# EAGLE design TowerLight (EAGLE 6.6.0)
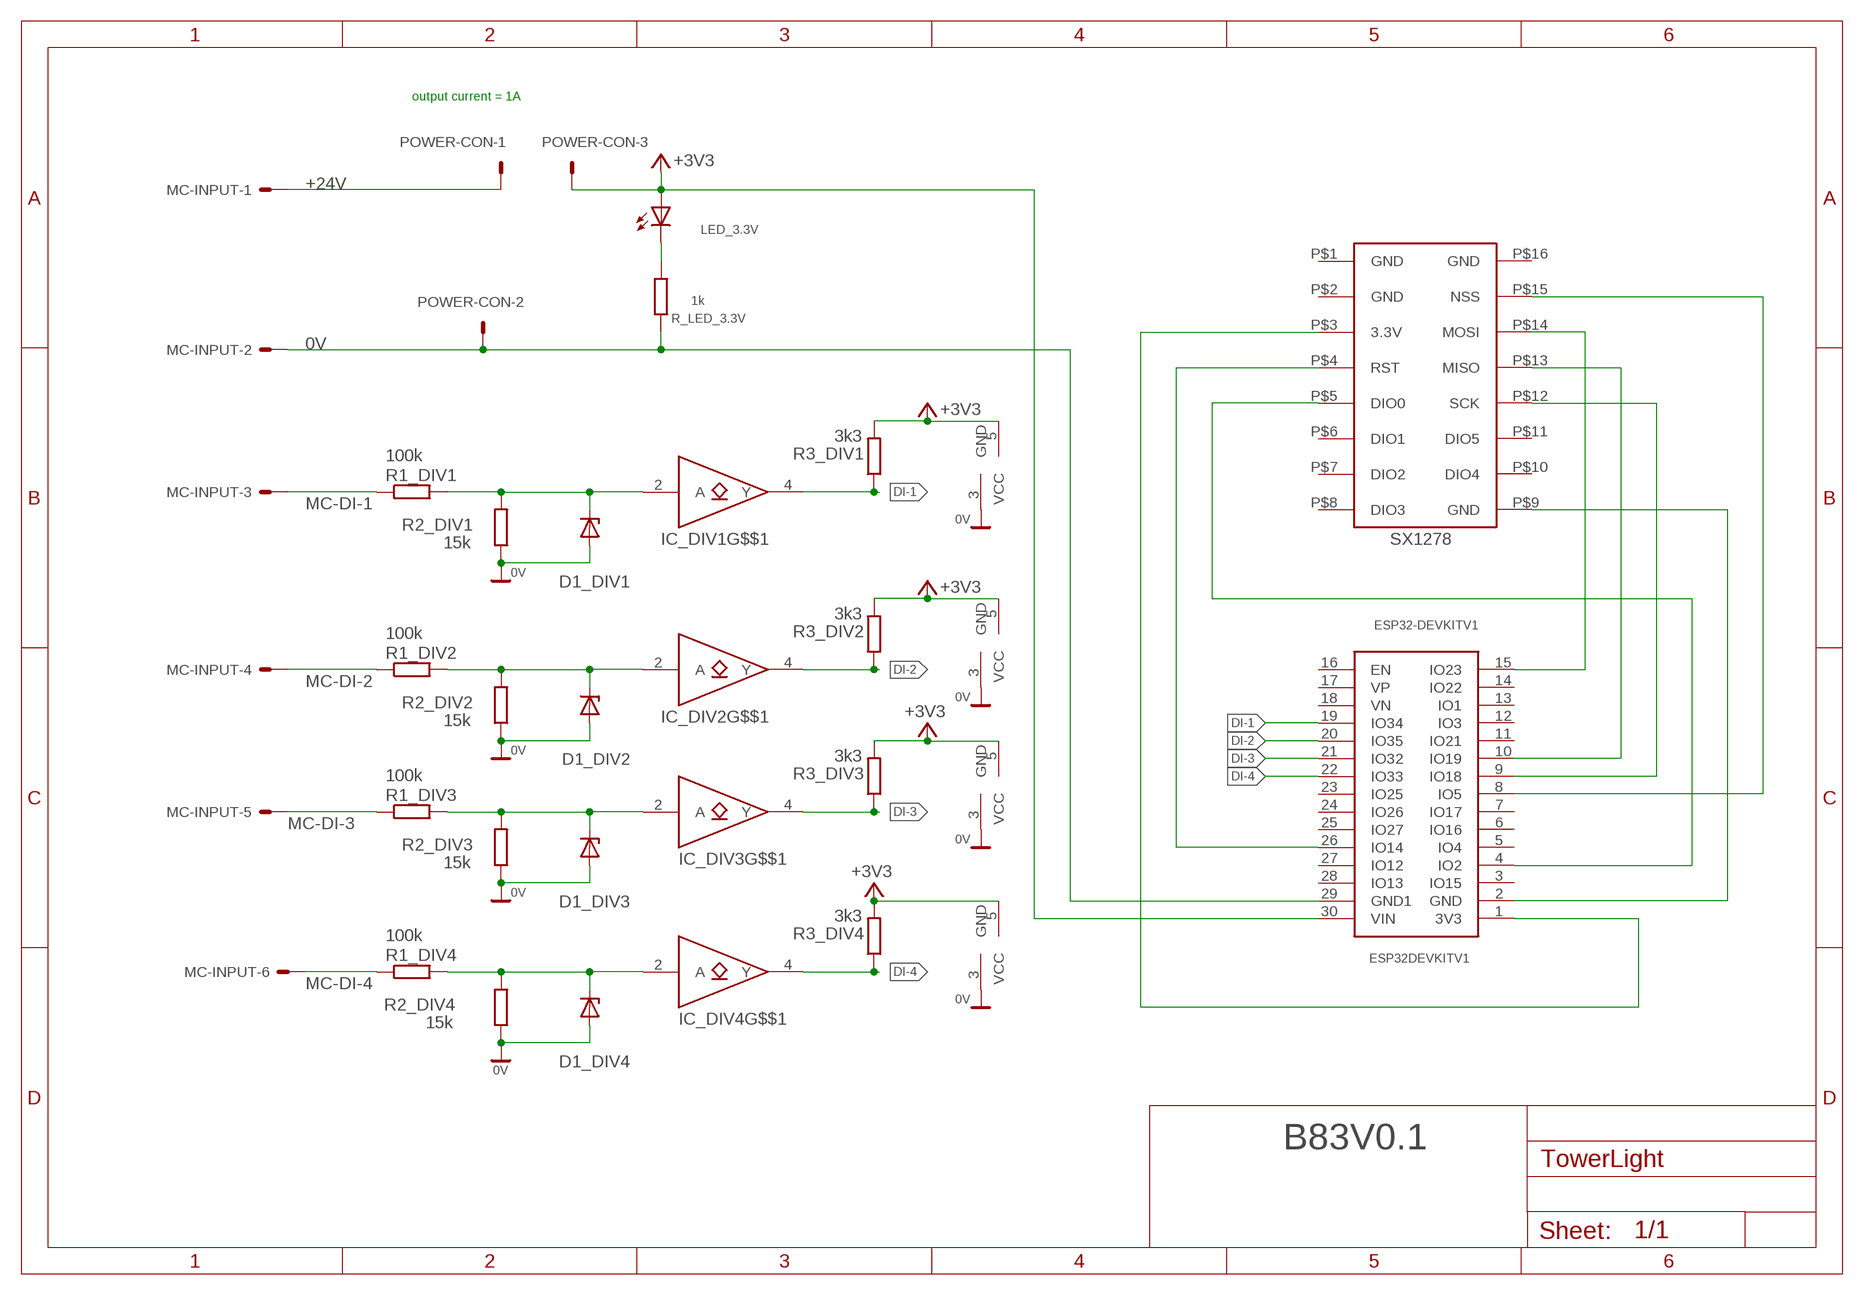
[diagram p0: schematic, sheet 1]

## Parts
D1_DIV1  ZENER-DIODEDO34-7  [DO34Z7]
D1_DIV2  ZENER-DIODEDO34-7  [DO34Z7]
D1_DIV3  ZENER-DIODEDO34-7  [DO34Z7]
D1_DIV4  ZENER-DIODEDO34-7  [DO34Z7]
ESP32DEVKITV1  ESP32DEVKITV1  [ESP32-DEVKITV1]
IC_DIV1  SN74LVC1G07DBVR  [SOT23-5L]
IC_DIV2  SN74LVC1G07DBVR  [SOT23-5L]
IC_DIV3  SN74LVC1G07DBVR  [SOT23-5L]
IC_DIV4  SN74LVC1G07DBVR  [SOT23-5L]
LED_3.3V  LED_SUB  [LED_SUBMINI]
MC-INPUT  22-05-7068-06  [7395-06]
POWER-CON  22-05-7038-03  [7395-03]
R1_DIV1  100k  R-EU_R1206  [R1206]
R1_DIV2  100k  R-EU_R1206  [R1206]
R1_DIV3  100k  R-EU_R1206  [R1206]
R1_DIV4  100k  R-EU_R1206  [R1206]
R2_DIV1  15k  R-EU_R1206  [R1206]
R2_DIV2  15k  R-EU_R1206  [R1206]
R2_DIV3  15k  R-EU_R1206  [R1206]
R2_DIV4  15k  R-EU_R1206  [R1206]
R3_DIV1  3k3  R-EU_R1206  [R1206]
R3_DIV2  3k3  R-EU_R1206  [R1206]
R3_DIV3  3k3  R-EU_R1206  [R1206]
R3_DIV4  3k3  R-EU_R1206  [R1206]
R_LED_3.3V  1k  R-EU_R1206  [R1206]
U$2  SX1278_MODULE  [SX1278_MODULE]

## Nets
0V: D1_DIV1.A D1_DIV2.A D1_DIV3.A D1_DIV4.A ESP32DEVKITV1.29(GND1) IC_DIV1.3(@:GND) IC_DIV2.3(@:GND) IC_DIV3.3(@:GND) IC_DIV4.3(@:GND) MC-INPUT.2 POWER-CON.2 R2_DIV1.1 R2_DIV2.1 R2_DIV3.1 R2_DIV4.1 R_LED_3.3V.2
+3V3: ESP32DEVKITV1.30(VIN) IC_DIV1.5(@:VCC) IC_DIV2.5(@:VCC) IC_DIV3.5(@:VCC) IC_DIV4.5(@:VCC) LED_3.3V.P$1(A) POWER-CON.3 R3_DIV1.2 R3_DIV2.2 R3_DIV3.2 R3_DIV4.2
+24V: MC-INPUT.1 POWER-CON.1
DI-1: ESP32DEVKITV1.19(IO34) IC_DIV1.4(G$$1:Y) R3_DIV1.1
DI-2: ESP32DEVKITV1.20(IO35) IC_DIV2.4(G$$1:Y) R3_DIV2.1
DI-3: ESP32DEVKITV1.21(IO32) IC_DIV3.4(G$$1:Y) R3_DIV3.1
DI-4: ESP32DEVKITV1.22(IO33) IC_DIV4.4(G$$1:Y) R3_DIV4.1
IN_IC_DR0: D1_DIV1.C IC_DIV1.2(G$$1:A) R1_DIV1.2 R2_DIV1.2
IN_IC_DR1: D1_DIV2.C IC_DIV2.2(G$$1:A) R1_DIV2.2 R2_DIV2.2
IN_IC_DR2: D1_DIV3.C IC_DIV3.2(G$$1:A) R1_DIV3.2 R2_DIV3.2
IN_IC_DR3: D1_DIV4.C IC_DIV4.2(G$$1:A) R1_DIV4.2 R2_DIV4.2
MC-DI-1: MC-INPUT.3 R1_DIV1.1
MC-DI-2: MC-INPUT.4 R1_DIV2.1
MC-DI-3: MC-INPUT.5 R1_DIV3.1
MC-DI-4: MC-INPUT.6 R1_DIV4.1
N$1: ESP32DEVKITV1.2(GND) U$2.P$9(GND)
N$2: ESP32DEVKITV1.9(IO18) U$2.P$12(SCK)
N$3: LED_3.3V.P$2(C) R_LED_3.3V.1
N$4: ESP32DEVKITV1.10(IO19) U$2.P$13(MISO)
N$5: ESP32DEVKITV1.15(IO23) U$2.P$14(MOSI)
N$6: ESP32DEVKITV1.8(IO5) U$2.P$15(NSS)
N$7: ESP32DEVKITV1.4(IO2) U$2.P$5(DIO0)
N$8: ESP32DEVKITV1.1(3V3) U$2.P$3(3.3V)
N$9: ESP32DEVKITV1.26(IO14) U$2.P$4(RST)
Unconnected: ESP32DEVKITV1.3(IO15) ESP32DEVKITV1.5(IO4) ESP32DEVKITV1.6(IO16) ESP32DEVKITV1.7(IO17) ESP32DEVKITV1.11(IO21) ESP32DEVKITV1.12(IO3) ESP32DEVKITV1.13(IO1) ESP32DEVKITV1.14(IO22) ESP32DEVKITV1.16(EN) ESP32DEVKITV1.17(VP) ESP32DEVKITV1.18(VN) ESP32DEVKITV1.23(IO25) ESP32DEVKITV1.24(IO26) ESP32DEVKITV1.25(IO27) ESP32DEVKITV1.27(IO12) ESP32DEVKITV1.28(IO13) U$2.P$1(GND) U$2.P$2(GND) U$2.P$6(DIO1) U$2.P$7(DIO2) U$2.P$8(DIO3) U$2.P$10(DIO4) U$2.P$11(DIO5) U$2.P$16(GND)

## Notes on the sheet
- output current = 1A
- B83V0.1

## Library data of the parts
D1_DIV1-D1_DIV4 = diode:ZENER-DIODE: Z-Diode
ESP32DEVKITV1 = ESP32-DEVKITV1:ESP32DEVKITV1
IC_DIV1-IC_DIV4 = TI SN74LVC1G07:SN74LVC1G07*: Single buffer/driver with Open-drain output Texas Instruments created by Simon Wong Peng Soon 30th November 2010 Rev:1.00
LED_3.3V = ZH:LED_SUB
MC-INPUT = con-molex:22-?-06: CONNECTOR wire to board 2.54 mm (.1 inch) pitch header; OC_FARNELL: unknown; OC_NEWARK: unknown
POWER-CON = con-molex:22-?-03: CONNECTOR wire to board 2.54 mm (.1 inch) pitch header; OC_FARNELL: unknown; OC_NEWARK: unknown
R1_DIV1-R1_DIV4 R2_DIV1-R2_DIV4 R3_DIV1-R3_DIV4 R_LED_3.3V = rcl:R-EU_: RESISTOR, European symbol
U$2 = simon:SX1278_MODULE: LoRa Module

## Board
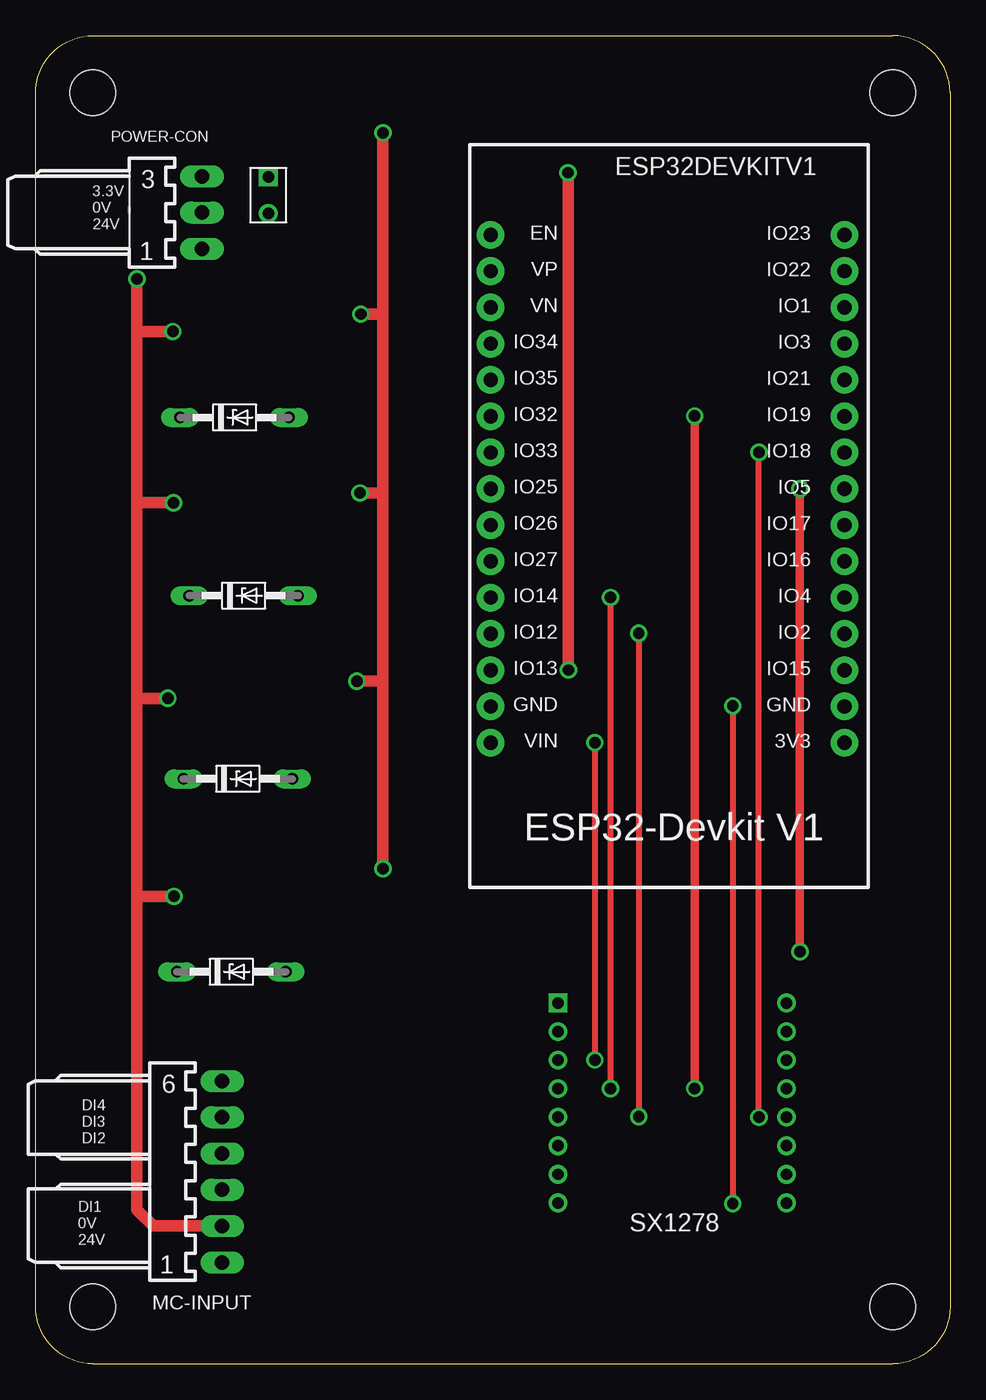
[diagram p1: board, top side]
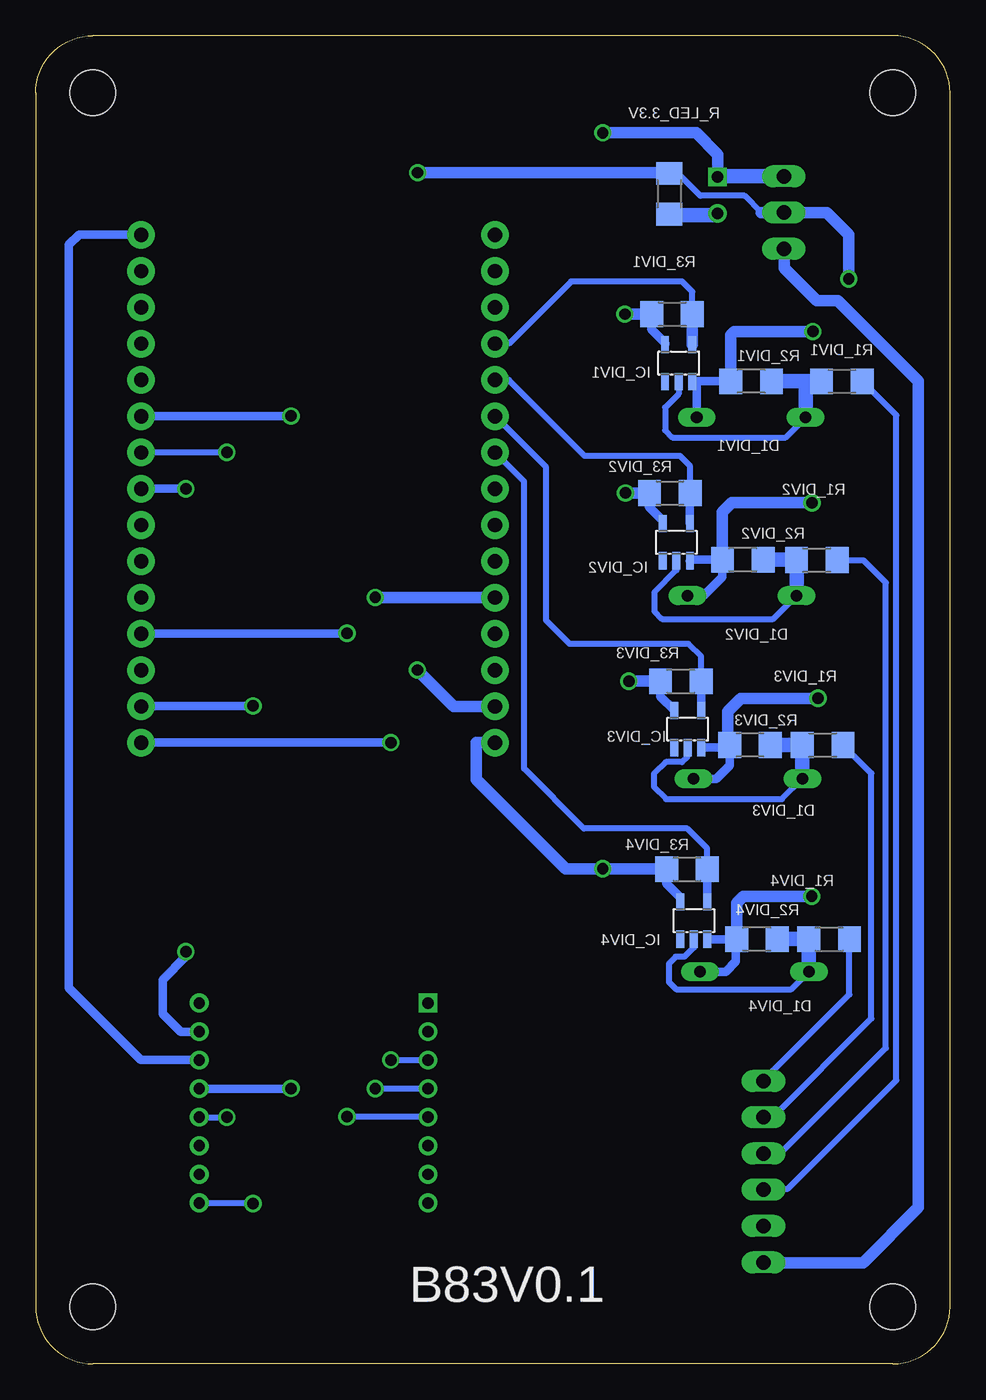
[diagram p2: board, bottom side, seen from below]

Size 64 x 93 mm. Coordinates in mm from the lower left corner, seen from the top.
Outline: 4,0 arc-90 0,4 0,89 arc-90 4,93 60,93 arc-90 64,89 64,4 arc-90 60,0 4,0
Copper layers (1*16): Top 0.035mm / dielectric 1.5mm / Bottom 0.035mm
Design rules "default *": minimum track width 10mil, minimum drill 24mil, track to track 8mil, track to pad 8mil, pad to pad 8mil, via to via 8mil, smd to smd 8mil, copper to edge 40mil, drill to drill 8mil, minimum pad ring 10mil, minimum via ring 8mil, stop-mask expansion 4mil, vias tented up to drill 0mil, thermal gap 10mil
Holes 3.2 mm at 4,4 60,4 4,89 60,89

### Footprints (pad centres in the part's own frame; a part is rotated, then mirrored left to right if it is on the bottom)
DO34Z7 = drill 0.813 long: A 3.81,0; C -3.81,0
ESP32-DEVKITV1 = drill 1 pad 1.93: 1 11,-13.98; 2 11,-11.44; 3 11,-8.9; 4 11,-6.36; 5 11,-3.82; 6 11,-1.28; 7 11,1.26; 8 11,3.8; 9 11,6.34; 10 11,8.88; 11 11,11.42; 12 11,13.96; 13 11,16.5; 14 11,19.04; 15 11,21.58; 16 -13.77,21.58; 17 -13.77,19.04; 18 -13.77,16.5; 19 -13.77,13.96; 20 -13.77,11.42; 21 -13.77,8.88; 22 -13.77,6.34; 23 -13.77,3.8; 24 -13.77,1.26; 25 -13.77,-1.28; 26 -13.77,-3.82; 27 -13.77,-6.36; 28 -13.77,-8.9; 29 -13.77,-11.44; 30 -13.77,-13.98
SOT23-5L = smd 0.55 x 1.2: 1 -0.95,-1.3; 2 0,-1.3; 3 0.95,-1.3; 4 0.95,1.3; 5 -0.95,1.3
LED_SUBMINI = drill 0.8 square: P$1 0,2.54 | drill 0.8: P$2 0,0
7395-06 = drill 1.016 long: 1 6.35,0; 2 3.81,0; 3 1.27,0; 4 -1.27,0; 5 -3.81,0; 6 -6.35,0
7395-03 = drill 1.016 long: 1 2.54,0; 2 0,0; 3 -2.54,0
R1206 = smd 1.6 x 1.803: 1 -1.422,0; 2 1.422,0
SX1278_MODULE = drill 0.8 square: P$1 0,0 | drill 0.8: P$2 0,-2; P$3 0,-4; P$4 0,-6; P$5 0,-8; P$6 0,-10; P$7 0,-12; P$8 0,-14; P$9 16,-14; P$10 16,-12; P$11 16,-10; P$12 16,-8; P$13 16,-6; P$14 16,-4; P$15 16,-2; P$16 16,0

### Placement (x,y rotation side)
D1_DIV1  13.92,66.26 0 top
D1_DIV2  14.55,53.79 0 top
D1_DIV3  14.15,40.96 0 top
D1_DIV4  13.69,27.45 0 top
ESP32DEVKITV1  45.62,57.47 0 top
IC_DIV1  19,70.07 0 bottom
IC_DIV2  19.15,57.53 0 bottom
IC_DIV3  18.36,44.44 0 bottom
IC_DIV4  17.93,31.03 0 bottom
LED_3.3V  16.28,80.56 0 top
MC-INPUT  13.06,13.46 270 top
POWER-CON  11.63,80.61 270 top
R1_DIV1  7.57,68.8 180 bottom
R1_DIV2  9.32,56.28 180 bottom
R1_DIV3  8.92,43.33 180 bottom
R1_DIV4  8.46,29.74 180 bottom
R2_DIV1  13.92,68.8 0 bottom
R2_DIV2  14.5,56.31 0 bottom
R2_DIV3  14,43.33 0 bottom
R2_DIV4  13.51,29.74 0 bottom
R3_DIV1  19.46,73.5 180 bottom
R3_DIV2  19.61,60.98 180 bottom
R3_DIV3  18.85,47.8 180 bottom
R3_DIV4  18.41,34.64 180 bottom
R_LED_3.3V  19.66,81.93 90 bottom
U$2  36.55,25.27 0 top

### Tracks (layer width: path | path; a pad name or v marks a point on that pad's centre or on a via)
0V  (via drill 0.8)
  Top 0.813: v7.09,75.97 7.09,72.31 | 7.09,72.31 7.09,60.24 | 7.09,60.24 7.09,46.65 | 7.09,46.65 7.09,32.63 | 7.09,32.63 7.09,10.79 8.23,9.65 MC-INPUT.2 | v9.6,72.28 7.11,72.28 7.09,72.31 | v9.65,60.29 7.14,60.29 7.09,60.24 | v9.25,46.6 7.14,46.6 7.09,46.65 | v9.68,32.73 7.19,32.73 7.09,32.63 | v37.29,48.59 37.29,83.38 v37.26,83.41
  Bottom 0.406: POWER-CON.2 13.21,80.61 14.38,81.78 17.48,81.78 19.05,83.36 R_LED_3.3V.2
  Bottom 0.61: D1_DIV1.A 17.73,68.45 IC_DIV1.3 18.02,68.8 R2_DIV1.1 | IC_DIV2.3 18.12,56.31 R2_DIV2.1 15.93,55.09 17.22,53.79 D1_DIV2.A | IC_DIV3.3 15.6,43.14 15.54,43.2 R2_DIV3.1 15.42,41.9 16.36,40.97 D1_DIV3.A | IC_DIV4.3 R2_DIV4.1 14.99,29.69 14.99,28.16 15.7,27.45 D1_DIV4.A
  Bottom 0.813: 13.21,80.61 8.64,80.61 7.09,79.06 v7.09,75.97 | R2_DIV1.1 15.34,72.03 15.09,72.28 v9.6,72.28 | R2_DIV2.1 15.93,59.66 15.29,60.29 v9.65,60.29 | 15.54,43.2 15.54,45.67 14.63,46.58 9.27,46.58 v9.25,46.6 | R2_DIV4.1 14.94,32.28 14.48,32.73 v9.68,32.73 | 37.27,48.6 v37.29,48.59 34.74,46.03 ESP32DEVKITV1.29 | v37.26,83.41 19.71,83.41 R_LED_3.3V.2
+3V3  (via drill 0.8)
  Top 0.813: v24.31,34.66 24.31,47.95 | 24.31,47.95 24.31,61.08 | 24.31,61.08 24.31,73.6 | 24.31,73.6 v24.31,86.2 | v22.76,73.5 24.21,73.5 24.31,73.6 | v22.71,60.98 24.21,60.98 24.31,61.08 | v22.48,47.8 24.16,47.8 24.31,47.95
  Bottom 0.61: IC_DIV1.5 19.95,71.48 20.9,72.44 20.9,73.48 R3_DIV1.2 | IC_DIV2.5 20.1,59.03 21.08,60.02 21.08,60.93 R3_DIV2.2 | IC_DIV3.5 19.31,45.77 20.27,46.73 R3_DIV3.2 | R3_DIV3.2 | IC_DIV4.5 18.88,32.64 19.86,33.62 19.86,34.61 R3_DIV4.2
  Bottom 0.813: R3_DIV4.2 24.28,34.64 v24.31,34.66 26.9,34.66 33.15,40.91 33.15,43.49 ESP32DEVKITV1.30 | v24.31,86.2 17.78,86.2 16.26,84.68 16.26,83.13 LED_3.3V.P$1 | R3_DIV1.2 v22.76,73.5 | R3_DIV2.2 v22.71,60.98 | R3_DIV3.2 v22.48,47.8
  Bottom 1.016: POWER-CON.3 16.23,83.15 LED_3.3V.P$1
+24V
  Bottom 0.406: POWER-CON.1 11.63,77.97 11.61,77.95
  Bottom 0.813: 11.61,77.95 11.61,76.73 9.32,74.44 7.85,74.44 2.21,68.8 2.21,10.94 6.07,7.08 13.03,7.08 MC-INPUT.1
DI-1
  Bottom 0.406: R3_DIV1.1 18.03,75.08 18.75,75.79 26.52,75.79 30.86,71.44 31.84,71.44 ESP32DEVKITV1.19
  Bottom 0.61: 18.05,73.49 R3_DIV1.1
  Bottom 0.813: 18.05,73.49 IC_DIV1.4
DI-2
  Bottom 0.406: R3_DIV2.1 18.19,62.86 18.9,63.57 25.57,63.57 26.06,64.06 26.68,64.68 30.89,68.89 31.84,68.89 ESP32DEVKITV1.20
  Bottom 0.61: IC_DIV2.4 18.2,60.97 R3_DIV2.1
DI-3
  Bottom 0.406: R3_DIV3.1 17.43,49.55 18.29,50.41 26.62,50.41 28.27,52.06 28.27,62.78 ESP32DEVKITV1.21
  Bottom 0.61: IC_DIV3.4 17.41,47.79 R3_DIV3.1
DI-4
  Bottom 0.406: R3_DIV4.1 16.99,36.09 18.39,37.48 25.63,37.48 29.82,41.68 29.82,61.79 ESP32DEVKITV1.22
  Bottom 0.61: IC_DIV4.4 16.98,34.63 R3_DIV4.1
IN_IC_DR0
  Bottom 0.406: IC_DIV1.2 19,67.91 19.94,66.97 19.94,65.37 19.43,64.87 11.51,64.87 D1_DIV1.C
  Bottom 1.016: R1_DIV1.2 10.16,68.8 | 10.16,68.8 R2_DIV1.2 | D1_DIV1.C 10.11,68.75 10.16,68.8
IN_IC_DR1
  Bottom 0.406: IC_DIV2.2 19.15,55.57 20.7,54.02 20.7,52.7 20.17,52.17 12.37,52.17 D1_DIV2.C
  Bottom 1.016: D1_DIV2.C R1_DIV2.2 10.77,56.31 R2_DIV2.2
IN_IC_DR2
  Bottom 0.406: IC_DIV3.2 18.36,42.54 18.77,42.13 19.91,42.13 20.73,41.32 20.73,40.41 19.86,39.54 11.76,39.54 D1_DIV3.C
  Bottom 1.016: R2_DIV3.2 R1_DIV3.2 D1_DIV3.C
IN_IC_DR3
  Bottom 0.406: IC_DIV4.2 17.93,29.15 18.59,28.49 19.2,28.49 19.68,28.01 19.68,26.74 19.18,26.23 11.1,26.23 D1_DIV4.C
  Bottom 1.016: R2_DIV4.2 R1_DIV4.2 D1_DIV4.C
MC-DI-1
  Bottom 0.406: MC-INPUT.3 13.16,12.19 13.23,12.26 11.35,12.26 3.76,19.86 3.76,66.42 R1_DIV1.1
MC-DI-2
  Bottom 0.406: MC-INPUT.4 11.89,14.73 4.5,22.12 4.5,54.71 6.04,56.26 7.87,56.26 R1_DIV2.1
MC-DI-3
  Bottom 0.406: MC-INPUT.5 12.42,17.27 5.51,24.18 5.51,41.34 R1_DIV3.1
MC-DI-4
  Bottom 0.406: 13.06,19.83 7.04,25.85 R1_DIV4.1
  Bottom 0.813: MC-INPUT.6 13.06,19.83 | R1_DIV4.1
N$1  (via drill 0.8)
  Top 0.406: v48.79,46.07 v48.79,11.22
  Bottom 0.406: 48.8,46.06 v48.79,46.07 | v48.79,11.22 52.5,11.22 U$2.P$9
  Bottom 0.61: 48.8,46.06 56.59,46.06 ESP32DEVKITV1.2
N$2  (via drill 0.8)
  Top 0.406: v50.62,17.27 v50.62,63.83
  Bottom 0.406: U$2.P$12 v50.62,17.27 | v50.62,63.83 56.61,63.83 ESP32DEVKITV1.9
N$3
  Bottom 0.406: LED_3.3V.P$2 16.33,80.56 16.46,80.44
  Bottom 1.016: 16.46,80.44 19.58,80.44 R_LED_3.3V.1
N$4  (via drill 0.8)
  Top 0.61: v46.13,19.28 v46.13,66.37
  Bottom 0.61: U$2.P$13 46.14,19.27 v46.13,19.28 | v46.13,66.37 56.6,66.37 ESP32DEVKITV1.10
N$5
  Bottom 0.61: U$2.P$14 52.56,21.28 56.64,21.28 61.67,26.31 61.67,78.35 60.95,79.08 56.64,79.08 ESP32DEVKITV1.15
N$6  (via drill 0.8)
  Top 0.61: v53.49,61.27 v53.49,28.85
  Bottom 0.61: ESP32DEVKITV1.8 53.5,61.27 v53.49,61.27 | v53.49,28.85 53.49,28.52 55.12,26.9 55.12,24.51 53.85,23.24 52.58,23.24 U$2.P$15
N$7  (via drill 0.8)
  Top 0.406: v42.22,51.15 v42.22,17.32
  Bottom 0.406: 42.23,51.14 v42.22,51.15 | v42.22,17.32 36.6,17.32 U$2.P$5
  Bottom 0.61: 42.23,51.14 56.59,51.14 ESP32DEVKITV1.4
N$8  (via drill 0.8)
  Top 0.406: v39.14,43.51 v39.14,21.28
  Bottom 0.406: 39.16,43.52 v39.14,43.51 | v39.14,21.28 36.56,21.28 U$2.P$3
  Bottom 0.61: 39.16,43.52 56.59,43.52 ESP32DEVKITV1.1
N$9  (via drill 0.8)
  Top 0.406: v40.23,53.66 v40.23,19.27
  Bottom 0.406: 40.22,53.68 v40.23,53.66 | v40.23,19.27 U$2.P$4
  Bottom 0.813: ESP32DEVKITV1.26 v40.22,53.66 v40.23,53.66

### Text on the board
tNames: 3.3V / 0V / 24V | DI4 / DI3 / DI2 | DI1 / 0V / 24V
bNames: B83V0.1